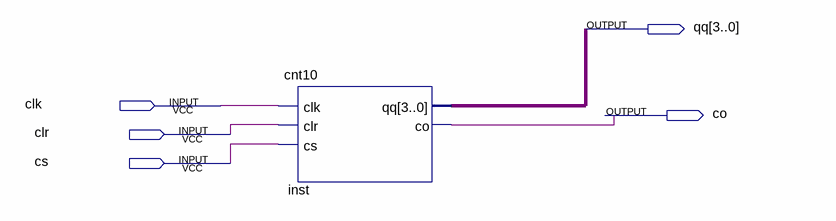
[diagram p0: schematic sheet]
// Quartus schematic cnt101.bdf as structural Verilog: 1 symbols, 5 pins
module cnt101 (
  input  clk,
  input  clr,
  input  cs,
  output [3:0] qq,
  output co
);

  wire inst_co;

  cnt10 inst (.clk(clk), .clr(clr), .cs(cs), .qq(qq), .co(inst_co));
endmodule
